# Altium schematic sheet AC_DC.SchDoc
size A4
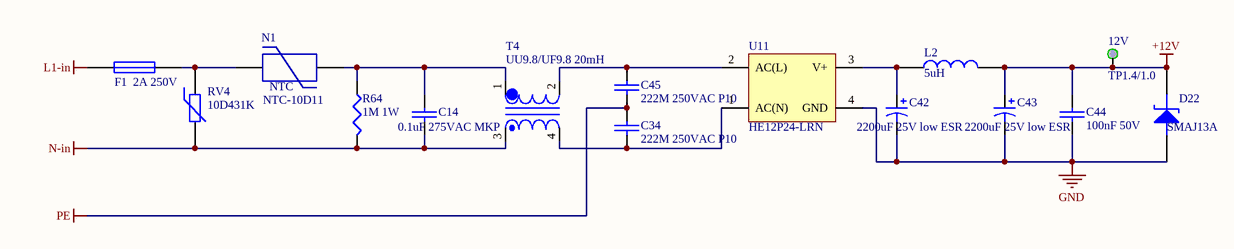
[diagram p0: AC_DC.SchDoc]

## Parts
12V  TP1.4/1.0  [TP1.4/1.0]  (no BOM)
C14  0.1uF 275VAC MKP  [0.1uF 275VAC MKP]
C34  222M 250VAC P10  [CAPRD10-9x5]
C42  2200uF 25V low ESR  [CAPPR7.5-16x25]
C43  2200uF 25V low ESR  [CAPPR7.5-16x25]
C44  100nF 50V  [CAPC2012N]
C45  222M 250VAC P10  [CAPRD10-9x5]
D22  SMAJ13A  [DSO-C2/G1.6]
F1  2A 250V  [FUSE-CASE-23mm]
L2  5uH  [Inductor9.5-11x21]
N1  NTC-10D11  [10D431K]
R64  1M 1W  [RES15-13.5X5]
RV4  10D431K  [10D431K]
T4  UU9.8/UF9.8 20mH  [UU9.8/UF9.8]
U11  HE12P24-LRN  [HIECUBE_AC_DC_24W]

## Nets
+12V: 12V.1 C43.1 C44.2 D22.2(K) L2.2
GND: C42.2 C43.2 C44.1 D22.1(A) U11.4(GND)
L1-in: F1.1
N-in: C14.1 R64.2 RV4.2 T4.3
PE: C34.2 C45.1
NetC14_2: C14.2 N1.2 R64.1 T4.1
NetC34_1: C34.1 T4.4 U11.1(AC(N))
NetC42_1: C42.1 L2.1 U11.3(V+)
NetC45_2: C45.2 T4.2 U11.2(AC(L))
NetF1_2: F1.2 N1.1 RV4.1

## Library data of the parts
C14 C34 C44 C45 = CAP: Capacitor
C42 C43 = Cap Pol1: Polarized Capacitor (Radial); Published: 8-Jun-2000; LatestRevisionDate: 17-Jul-2002; LatestRevisionNote: Re-released for DXP Platform.; PackageReference: RB7.6-15; Publisher: Altium Limited
D22 = ZENER2: Zener Diode; Manufacturer: Littlefuse; Price: 0.65
F1 = FUSE1: Fuse socket w/ cover; Price: 0.25
L2 = INDUCTOR: Radial type Inductor 2A
N1 = NTC: Thermister
R64 = Res3: Resistor
RV4 = Res Varistor: Varistor (Voltage-Sensitive Resistor); Published: 24-Mar-1999; LatestRevisionDate: 29-May-2009; LatestRevisionNote: IPC-7351 Footprint Added.; PackageVersion: Mar-2003; PackageReference: 6-0805; Publisher: Altium Limited; PackageDescription: Chip Resistor 0805 Case Size; Code_IPC: RESC2012
T4 = Balum UU9.8/UF9.8: Balum
U11 = HIECUBE_AC-DC_24W: HICUBE AC/DC 24W 12V